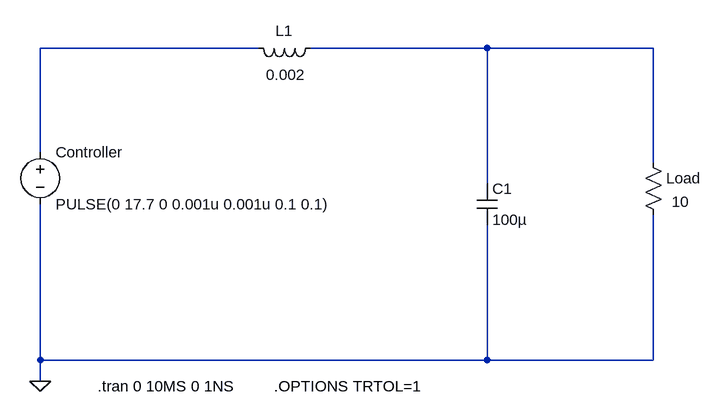
[diagram p0: schematic StepDownConverterRealisticValues.asc]
StepDownConverterRealisticValues.asc, the LTspice schematic file:
Version 4
SHEET 1 5120 680
WIRE 2960 -288 2624 -288
WIRE 3312 -288 3040 -288
WIRE 3568 -288 3312 -288
WIRE 2624 -128 2624 -288
WIRE 3568 -112 3568 -288
WIRE 3312 -80 3312 -288
WIRE 2624 192 2624 -48
WIRE 3312 192 3312 -16
WIRE 3312 192 2624 192
WIRE 3568 192 3568 -32
WIRE 3568 192 3312 192
WIRE 2624 224 2624 192
FLAG 2624 224 0
SYMBOL ind 3056 -304 R90
WINDOW 0 5 56 VBottom 2
WINDOW 3 41 54 VTop 2
SYMATTR InstName L1
SYMATTR Value 0.002
SYMATTR SpiceLine Rser=0.4
SYMBOL res 3552 -128 R0
WINDOW 3 44 76 Left 2
SYMATTR Value 10
SYMATTR InstName Load
SYMBOL voltage 2624 -144 R0
WINDOW 123 0 0 Left 0
WINDOW 39 0 0 Left 0
SYMATTR InstName Controller
SYMATTR Value PULSE(0 17.7 0 0.001u 0.001u 0.1 0.1)
SYMBOL cap 3296 -80 R0
SYMATTR InstName C1
SYMATTR Value 100µ
TEXT 2712 232 Left 2 !.tran 0 10MS 0 1NS
TEXT 2984 232 Left 2 !.OPTIONS TRTOL=1

The netlist it stands for:
* StepDownConverterRealisticValues.asc
L1 N002 N001 0.002 Rser=0.4
R§Load N002 0 10
V§Controller N001 0 PULSE(0 17.7 0 0.001u 0.001u 0.1 0.1)
C1 N002 0 100µ
.tran 0 10MS 0 1NS
.OPTIONS TRTOL=1
.backanno
.end